# Altium schematic sheet 02_MCU.SchDoc: 02_MCU
size A4; Organization: ASUS; Revision: V1; SheetNumber: 2; ProjectName: ATHENA
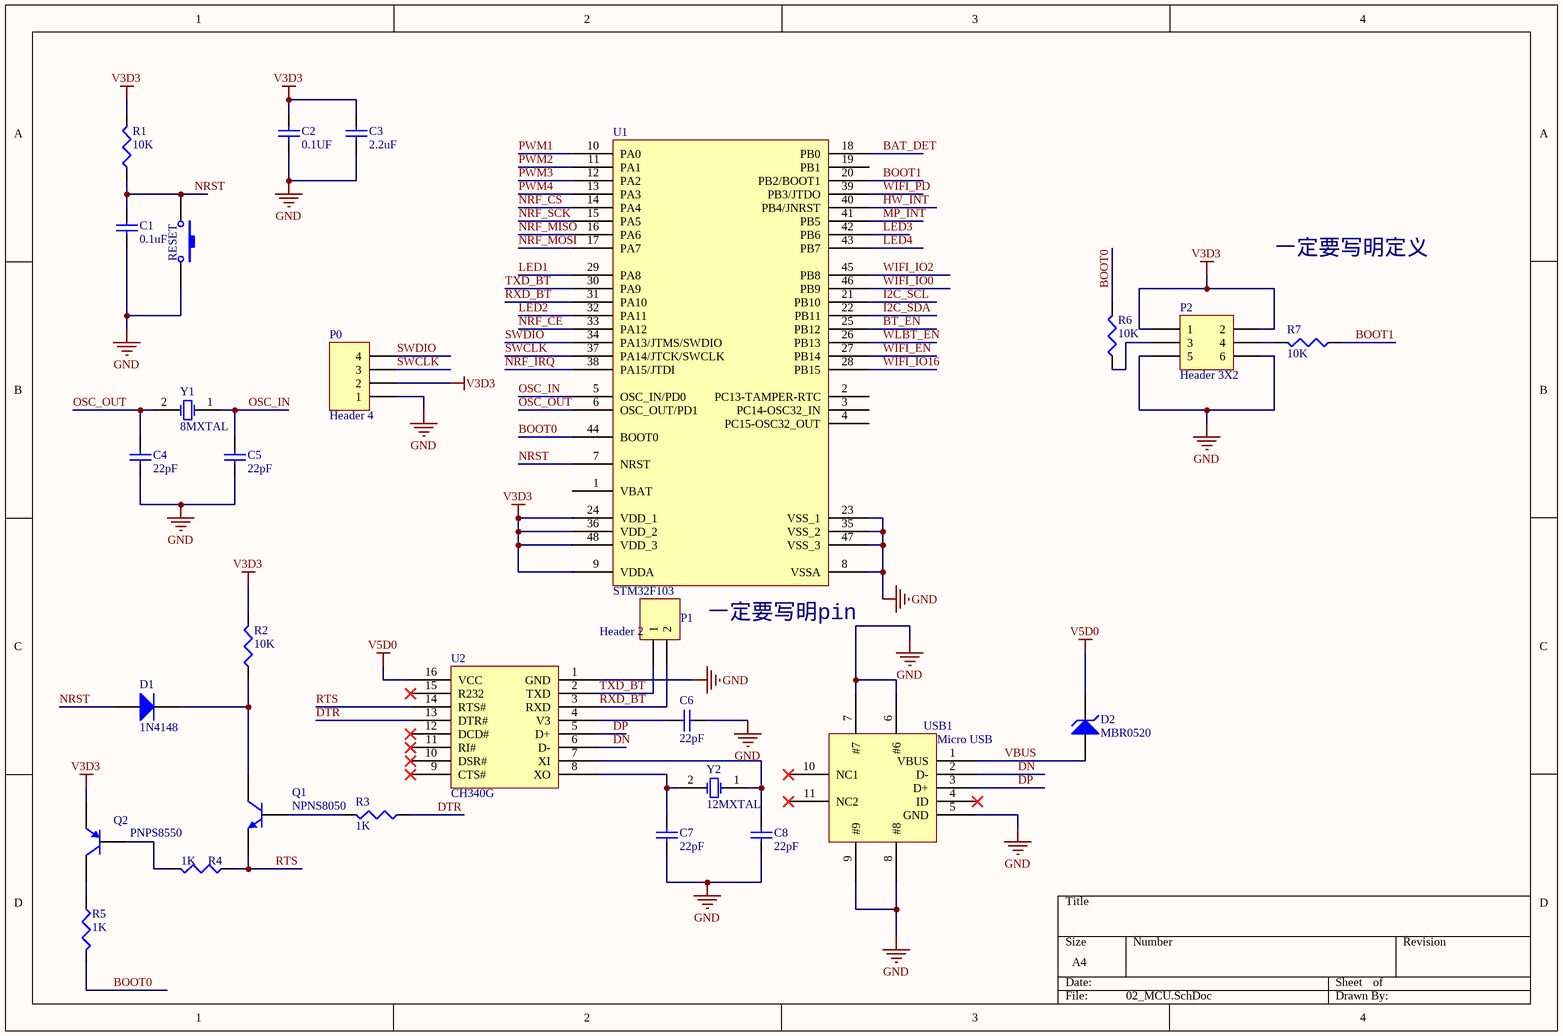
[diagram p0: 02_MCU.SchDoc]

## Parts
C1  value 0.1uF  [0402]  (hidden comment: Cap)
C2  value 0.1UF  [0402]  (hidden comment: Cap)
C3  value 2.2uF  [0402]  (hidden comment: Cap)
C4  value 22pF  [0402]  (hidden comment: Cap)
C5  value 22pF  [0402]  (hidden comment: Cap)
C6  value 22pF  [0402]  (hidden comment: Cap)
C7  value 22pF  [0402]  (hidden comment: Cap)
C8  value 22pF  [0402]  (hidden comment: Cap)
D1  1N4148  [0603]
D2  MBR0520  [6-0805_N]
P0  Header 4  [HDR1X4]
P1  Header 2  [HDR1X2]
P2  Header 3X2  [HDR2X3]
Q1  NPNS8050  [SOT-23_M]
Q2  PNPS8550  [SOT-23_M]
R1  value 10K  [0402]  (hidden comment: Res3)
R2  value 10K  [0402]  (hidden comment: Res3)
R3  value 1K  [0402]  (hidden comment: Res3)
R4  value 1K  [0402]  (hidden comment: Res3)
R5  value 1K  [0402]  (hidden comment: Res3)
R6  value 10K  [0402]  (hidden comment: Res3)
R7  value 10K  [0402]  (hidden comment: Res3)
RESET  SW-PB  [SWFOOT]  (value not drawn)
U1  STM32F103  [LQFP48S]
U2  CH340G  [SSOP16_M]
USB1  Micro USB  [Micro_USB]
Y1  8MXTAL  [XTAL2]
Y2  12MXTAL  [XTAL2]

## Nets
GND: C1.2 C2.2 C3.2 C4.2 C5.1 C6.1 C7.2 C8.1 P0.1 P2.5 P2.6 RESET.2 U1.8(VSSA) U1.23(VSS_1) U1.35(VSS_2) U1.47(VSS_3) U2.1(GND) USB1.5(GND) USB1.6(#6) USB1.7(#7) USB1.8(#8) USB1.9(#9)
V3D3: C2.1 C3.1 P0.2 P2.1 P2.2 Q2.3(E) R1.2 R2.2 U1.9(VDDA) U1.24(VDD_1) U1.36(VDD_2) U1.48(VDD_3)
V5D0: D2.2(K) U2.16(VCC)
BAT_DET: U1.18(PB0)
BOOT0: R5.2 R6.2 U1.44(BOOT0)
BOOT1: R7.1 U1.20(PB2/BOOT1)
BT_EN: U1.25(PB12)
DN: U2.6(D-) USB1.2(D-)
DP: U2.5(D+) USB1.3(D+)
DTR: R3.1 U2.13(DTR#)
HW_INT: U1.40(PB4/JNRST)
I2C_SCL: U1.21(PB10)
I2C_SDA: U1.22(PB11)
LED1: U1.29(PA8)
LED2: U1.32(PA11)
LED3: U1.42(PB6)
LED4: U1.43(PB7)
MP_INT: U1.41(PB5)
NRF_CE: U1.33(PA12)
NRF_CS: U1.14(PA4)
NRF_IRQ: U1.38(PA15/JTDI)
NRF_MISO: U1.16(PA6)
NRF_MOSI: U1.17(PA7)
NRF_SCK: U1.15(PA5)
NRST: C1.1 D1.1(A) R1.1 RESET.1 U1.7(NRST)
OSC_IN: C5.2 U1.5(OSC_IN/PD0) Y1.1(OSC1)
OSC_OUT: C4.1 U1.6(OSC_OUT/PD1) Y1.2(OSC2)
PWM1: U1.10(PA0)
PWM2: U1.11(PA1)
PWM3: U1.12(PA2)
PWM4: U1.13(PA3)
RTS: Q1.3(E) R4.1 U2.14(RTS#)
RXD_BT: P1.2 U1.31(PA10) U2.3(RXD)
SWCLK: P0.3 U1.37(PA14/JTCK/SWCLK)
SWDIO: P0.4 U1.34(PA13/JTMS/SWDIO)
TXD_BT: P1.1 U1.30(PA9) U2.2(TXD)
VBUS: D2.1(A) USB1.1(VBUS)
WIFI_EN: U1.27(PB14)
WIFI_IO0: U1.46(PB9)
WIFI_IO2: U1.45(PB8)
WIFI_IO16: U1.28(PB15)
WIFI_PD: U1.39(PB3/JTDO)
WLBT_EN: U1.26(PB13)
NetC6_2: C6.2 U2.4(V3)
NetC7_1: C7.1 U2.8(XO) Y2.2(OSC2)
NetC8_2: C8.2 U2.7(XI) Y2.1(OSC1)
NetD1_2: D1.2(K) Q1.1(C) R2.1
NetP2_3: P2.3 R6.1
NetP2_4: P2.4 R7.2
NetQ1_2: Q1.2(B) R3.2
NetQ2_1: Q2.1(C) R5.1
NetQ2_2: Q2.2(B) R4.2

Not connected (* = marked no-connect by the designer): U1 1(VBAT) 2(PC13-TAMPER-RTC) 3(PC14-OSC32_IN) 4(PC15-OSC32_OUT) 19(PB1); U2 9(CTS#)* 10(DSR#)* 11(RI#)* 12(DCD#)* 15(R232)*; USB1 4(ID)* 10(NC1)* 11(NC2)*

## Notes on the sheet
- 一定要写明定义
- 一定要写明pin

## Library data of the parts
C1-C8 = Cap: Capacitor; Published: 8-Jun-2000; LatestRevisionDate: 17-Jul-2002; LatestRevisionNote: Re-released for DXP Platform.; PackageReference: RAD-0.3; Publisher: Altium Limited; PackageDescription: Radial Cap, Thru-Hole; 2 Leads; 0.3 in Pin Spacing
D1 = Diode 1N4148: High Conductance Fast Diode; Published: 8-Jun-2000; LatestRevisionDate: 17-Jul-2002; LatestRevisionNote: Re-released for DXP Platform.; DatasheetVersion: 1997; PackageReference: DO-35; Publisher: Altium Limited; PackageDescription: Diode, Axial; Body 3.8 x 1.9 mm (LxDia. max), Lead Dia. 0.53 mm (max); Code_JEDEC: DO-204-AH; ComponentLink1Description: Manufacturer Link; ComponentLink1URL: http://www.fairchildsemi.com/; ComponentLink2Description: Datasheet; ComponentLink2URL: http://www.fairchildsemi.com/ds/1N%2F1N4148.pdf
D2 = D Zener: Zener Diode; Published: 8-Jun-2000; LatestRevisionDate: 17-Jul-2002; LatestRevisionNote: Re-released for DXP Platform.; PackageReference: DIODE-0.7; Publisher: Altium Limited; PackageDescription: Diode, Thru-Hole; 2 Leads; 0.7 in Pin Spacing
P0 = Header 4: Header, 4-Pin; LatestRevisionDate: 17-Jul-2002; LatestRevisionNote: Re-released for DXP Platform.; Publisher: Altium Limited
P1 = Header 2: Header, 2-Pin; LatestRevisionDate: 17-Jul-2002; LatestRevisionNote: Re-released for DXP Platform.; Publisher: Altium Limited
P2 = Header 3X2: Header, 3-Pin, Dual row; LatestRevisionDate: 17-Jul-2002; LatestRevisionNote: Re-released for DXP Platform.; Publisher: Altium Limited
Q1 = NPN: NPN Bipolar Transistor; Published: 8-Jun-2000; LatestRevisionDate: 17-Jul-2002; LatestRevisionNote: Re-released for DXP Platform.; PackageReference: TO-226-AA; Publisher: Altium Limited; PackageDescription: TO, Flat Index; 3 In-Line, Axial Leads; Body Dia. 4.8mm; Leads 0.55 x 0.51 mm (max); Code_JEDEC: TO-226-AA
Q2 = PNP: PNP Bipolar Transistor; Published: 8-Jun-2000; LatestRevisionDate: 29-May-2009; LatestRevisionNote: IPC-7351 Footprint Added.; PackageVersion: Aug-1999; PackageReference: SOT-23B; Publisher: Altium Limited; PackageDescription: 3-Pin SOT-23 Package 0.95 mm Pitch, 2.4 mm Lead Span
R1-R7 = Res3: Resistor; Published: 8-Jun-2000; LatestRevisionDate: 29-May-2009; LatestRevisionNote: IPC-7351 Footprint Added.; PackageReference: J1-0603; Publisher: Altium Limited; PackageDescription: Chip Resistor
RESET = SW-PB: Switch; Published: 24-Mar-1999; LatestRevisionDate: 17-Jul-2002; LatestRevisionNote: Re-released for DXP Platform.; PackageReference: SPST-2; Publisher: Altium Limited; PackageDescription: Switch; 2 Leads
Y1 Y2 = XTAL: Crystal Oscillator; Published: 8-Jun-2000; LatestRevisionDate: 17-Jul-2002; LatestRevisionNote: Re-released for DXP Platform.; PackageReference: R38; Publisher: Altium Limited; PackageDescription: Crystal, Thru-Hole; 2 Leads; Body 3.1 x 8.2 mm (Dia.xH)